# EAGLE schematic LED-Test (EAGLE 8.3.0)
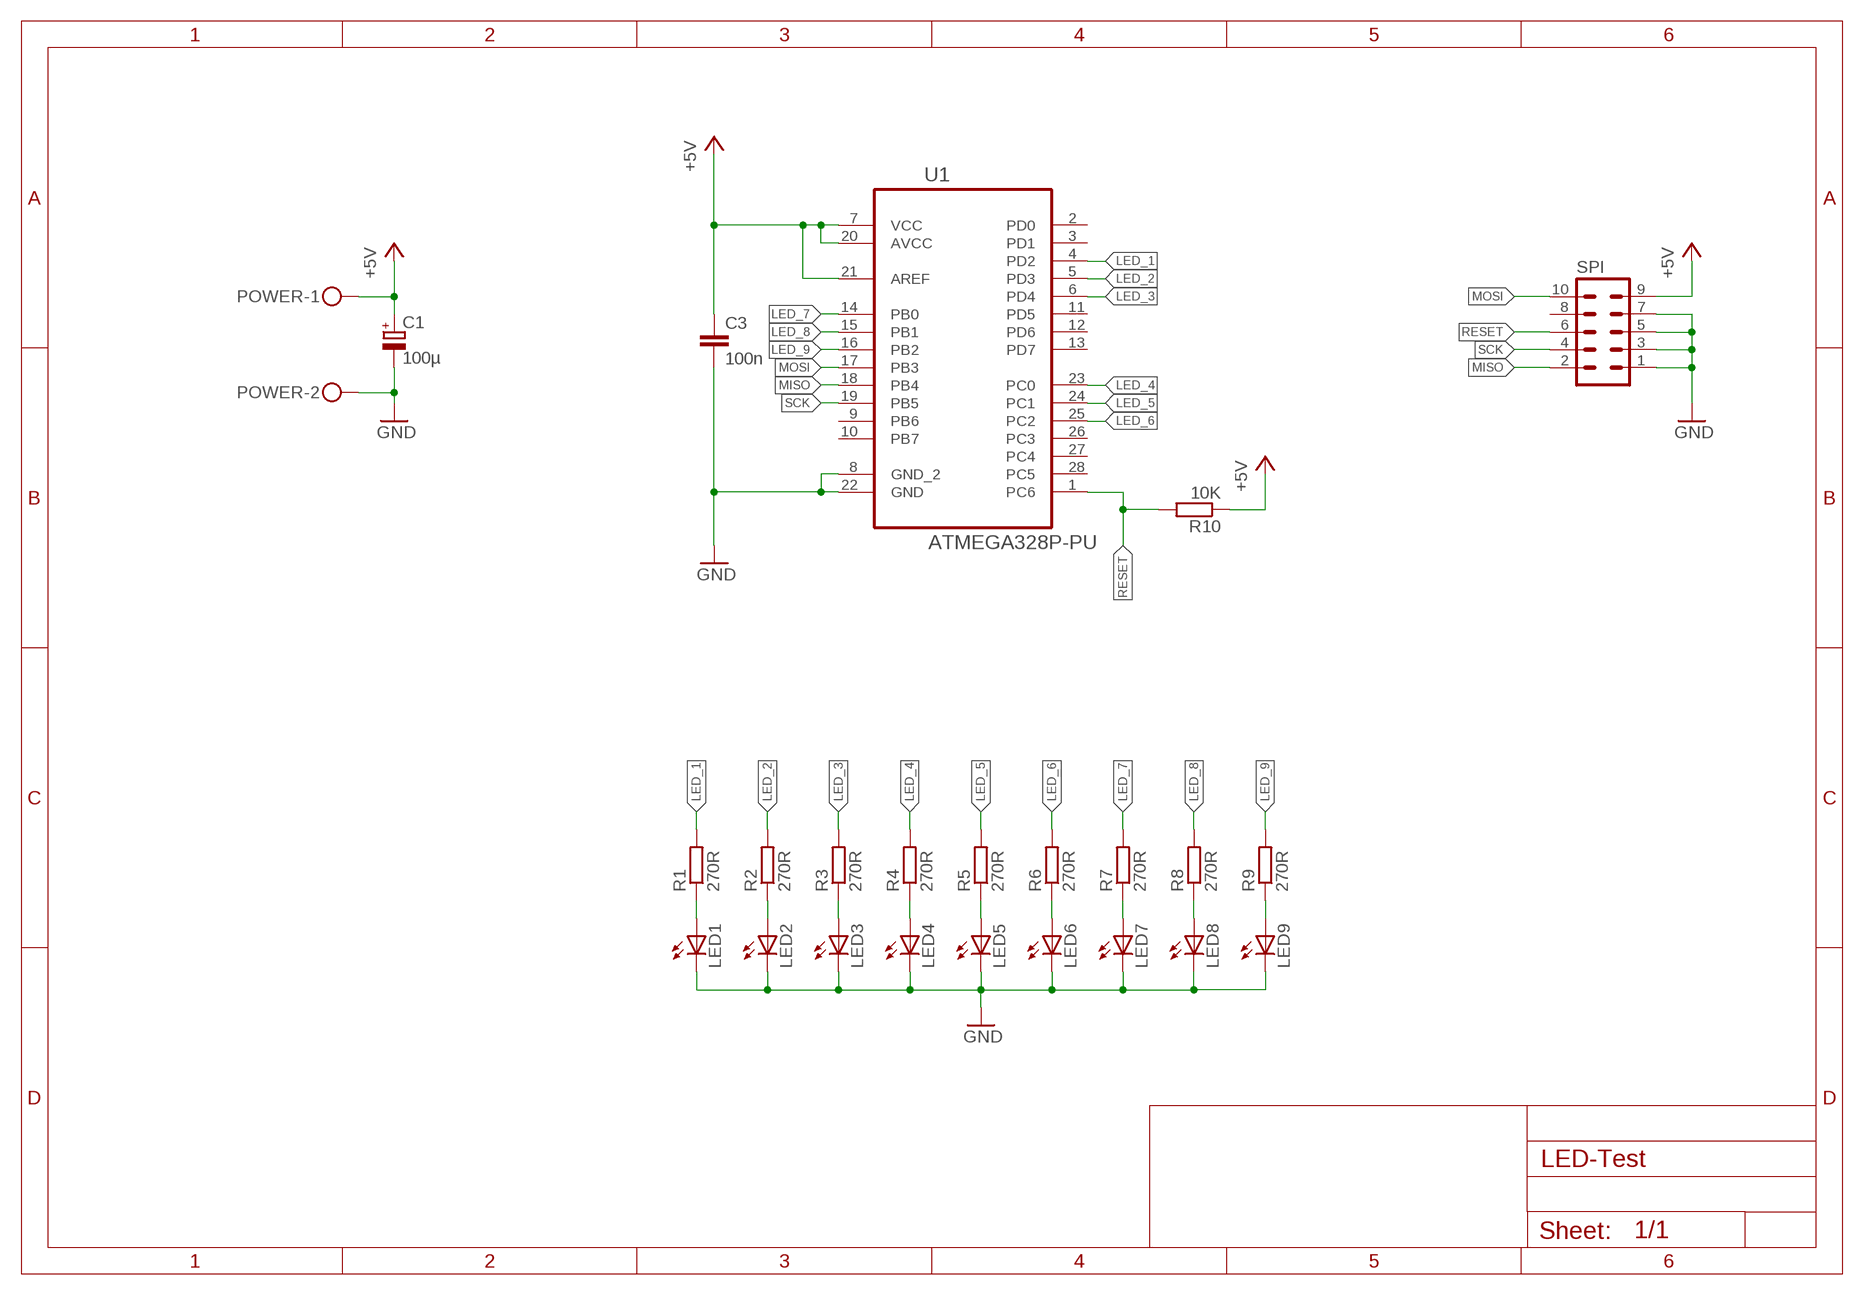
[diagram p0: schematic, sheet 1]

## Parts
C1  100µ  CPOL-EUE3.5-10  [E3,5-10]
C3  100n  C-EU025-025X050  [C025-025X050]
LED1  LED5MM  [LED5MM]
LED2  LED5MM  [LED5MM]
LED3  LED5MM  [LED5MM]
LED4  LED5MM  [LED5MM]
LED5  LED5MM  [LED5MM]
LED6  LED5MM  [LED5MM]
LED7  LED5MM  [LED5MM]
LED8  LED5MM  [LED5MM]
LED9  LED5MM  [LED5MM]
POWER  W237-102  [W237-102]
R1  270R  R-EU_0207/7  [0207/7]
R2  270R  R-EU_0207/7  [0207/7]
R3  270R  R-EU_0207/7  [0207/7]
R4  270R  R-EU_0207/7  [0207/7]
R5  270R  R-EU_0207/7  [0207/7]
R6  270R  R-EU_0207/7  [0207/7]
R7  270R  R-EU_0207/7  [0207/7]
R8  270R  R-EU_0207/7  [0207/7]
R9  270R  R-EU_0207/7  [0207/7]
R10  10K  R-EU_0207/7  [0207/7]
SPI  ML10  [ML10]
U1  ATMEGA328P-PU  [DIP254P762X457-28]

## Nets
+5V: C1.+ C3.1 POWER.1 R10.1 SPI.9 U1.7(VCC) U1.20(AVCC) U1.21(AREF)
GND: C1.- C3.2 LED1.K(C) LED2.K(C) LED3.K(C) LED4.K(C) LED5.K(C) LED6.K(C) LED7.K(C) LED8.K(C) LED9.K(C) POWER.2 SPI.1 SPI.3 SPI.5 SPI.7 U1.8(GND_2) U1.22(GND)
LED_1: R1.2 U1.4(PD2)
LED_2: R2.2 U1.5(PD3)
LED_3: R3.2 U1.6(PD4)
LED_4: R4.2 U1.23(PC0)
LED_5: R5.2 U1.24(PC1)
LED_6: R6.2 U1.25(PC2)
LED_7: R7.2 U1.14(PB0)
LED_8: R8.2 U1.15(PB1)
LED_9: R9.2 U1.16(PB2)
MISO: SPI.2 U1.18(PB4)
MOSI: SPI.10 U1.17(PB3)
N$1: LED1.A R1.1
N$2: LED2.A R2.1
N$3: LED3.A R3.1
N$4: LED4.A R4.1
N$5: LED5.A R5.1
N$6: LED6.A R6.1
N$7: LED7.A R7.1
N$8: LED8.A R8.1
N$10: LED9.A R9.1
RESET: R10.2 SPI.6 U1.1(PC6)
SCK: SPI.4 U1.19(PB5)
Unconnected: SPI.8 U1.2(PD0) U1.3(PD1) U1.9(PB6) U1.10(PB7) U1.11(PD5) U1.12(PD6) U1.13(PD7) U1.26(PC3) U1.27(PC4) U1.28(PC5)

## Library data of the parts
C1 = rcl:CPOL-EU: POLARIZED CAPACITOR, European symbol
C3 = rcl:C-EU: CAPACITOR, European symbol
LED1-LED9 = led:LED: LED OSRAM: - CHIPLED LG R971, LG N971, LY N971, LG Q971, LY Q971, LO R971, LY R971 LH N974, LH R974 LS Q976, LO Q976, LY Q976 LO Q996 - Hyper CHIPLED LW Q18S LB Q993, LB Q99A, LB R99A - SideLED LS A670, LO A670, LY A670, LG A670, LP A670 LB A673, LV A673, LT A673, LW A673 LH A674 LY A675 LS A676, LA A676, LO A676, LY A676, LW A676 LS A679, LY A679, LG A679 - Hyper Micro SIDELED® LS Y876, LA Y876, LO Y876, LY Y876 LT Y87S - SmartLED LW L88C, LW L88S LB L89C, LB L89S, LG L890 LS L89K, LO L89K, LY L89K LS L896, LA L896, LO L896, LY L896 - TOPLED LS T670, LO T670, LY T670, LG T670, LP T670 LSG T670, LSP T670, LSY T670, LOP T670, LYG T670 LG T671, LOG T671, LSG T671 LB T673, LV T673, LT T673, LW T673 LH T674 LS T676, LA T676, LO T676, LY T676, LB T676, LH T676, LSB T676, LW T676 LB T67C, LV T67C, LT T67C, LS T67K, LO T67K, LY T67K, LW E67C LS E67B, LA E67B, LO E67B, LY E67B, LB E67C, LV E67C, LT E67C LW T67C LS T679, LY T679, LG T679 LS T770, LO T770, LY T770, LG T770, LP T770 LB T773, LV T773, LT T773, LW T773 LH T774 LS E675, LA E675, LY E675, LS T675 LS T776, LA T776, LO T776, LY T776, LB T776 LHGB T686 LT T68C, LB T68C - Hyper Mini TOPLED® LB M676 - Mini TOPLED Santana® LG M470 LS M47K, LO M47K, LY M47K Source: http://www.osram.convergy.de LUXEON: - LUMILED® LXK2-PW12-R00, LXK2-PW12-S00, LXK2-PW14-U00, LXK2-PW14-V00 LXK2-PM12-R00, LXK2-PM12-S00, LXK2-PM14-U00 LXK2-PE12-Q00, LXK2-PE12-R00, LXK2-PE12-S00, LXK2-PE14-T00, LXK2-PE14-U00 LXK2-PB12-K00, LXK2-PB12-L00, LXK2-PB12-M00, LXK2-PB14-N00, LXK2-PB14-P00, LXK2-PB14-Q00 LXK2-PR12-L00, LXK2-PR12-M00, LXK2-PR14-Q00, LXK2-PR14-R00 LXK2-PD12-Q00, LXK2-PD12-R00, LXK2-PD12-S00 LXK2-PH12-R00, LXK2-PH12-S00 LXK2-PL12-P00, LXK2-PL12-Q00, LXK2-PL12-R00 Source: www.luxeon.com KINGBRIGHT: KA-3528ASYC Source: www.kingbright.com
POWER = con-wago-500:W237-102: WAGO SCREW CLAMP; MPN: 237-102; OC_FARNELL: unknown; OC_NEWARK: 70K9898
R1-R10 = rcl:R-EU_: RESISTOR, European symbol
SPI = con-ml:ML10: HARTING; OC_FARNELL: unknown; OC_NEWARK: unknown
U1 = Zap-Mikrocontroller:ATMEGA328P-PU: 8-bit Microcontroller with In-System Programmable Flash; MPN: ATMEGA328P-PU; OC_FARNELL: 1715487; OC_NEWARK: 15R0268; PACKAGE: PDIP-28; SUPPLIER: Atmel